# EAGLE schematic fsk_schematic (EAGLE 7.6.0)
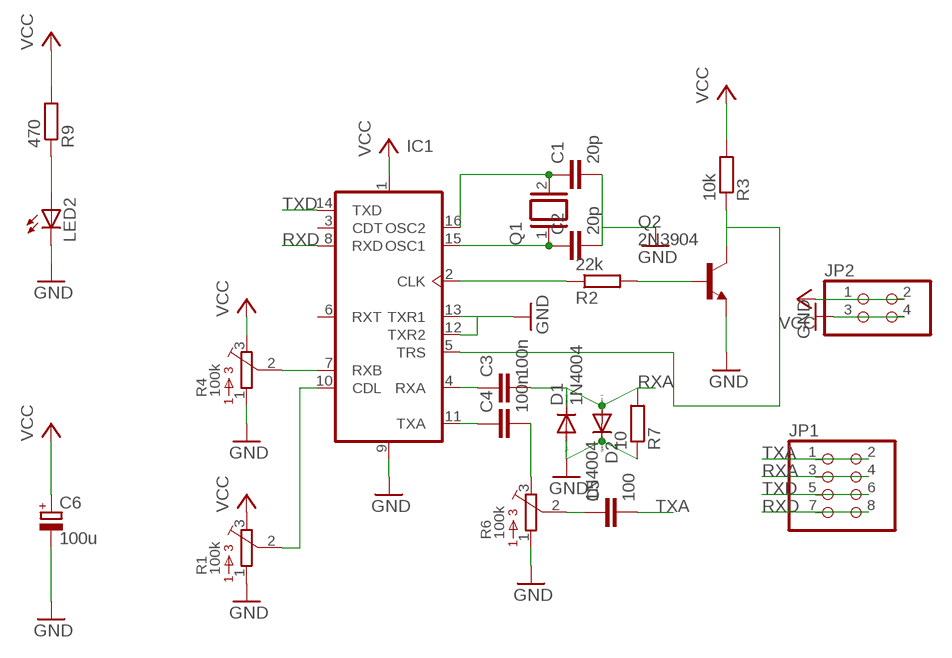
[diagram p0: schematic, sheet 1]

## Parts
C1  20p  C-EU025-024X044  [C025-024X044]
C2  20p  C-EU025-024X044  [C025-024X044]
C3  100n  C-EU050-045X075  [C050-045X075]
C4  100n  C-EU050-045X075  [C050-045X075]
C5  100  C-EU050-045X075  [C050-045X075]
C6  100u  CPOL-EUE2.5-7  [E2,5-7]
D1  1N4004  [DO41-10]
D2  1N4004  [DO41-10]
IC1  TCM3105  [DIL16]
JP1  PINHD-2X4  [2X04]
JP2  PINHD-2X2  [2X02]
LED2  LED5MM  [LED5MM]
Q1  XTAL/S  [QS]
Q2  2N3904  [TO92]
R1  100k  3386-C  [3386C]
R2  22k  R-EU_0204/7  [0204/7]
R3  10k  R-EU_0204/7  [0204/7]
R4  100k  3386-C  [3386C]
R6  100k  3386-C  [3386C]
R7  10  R-EU_0204/7  [0204/7]
R9  470  R-EU_0204/7  [0204/7]

## Nets
GND: C1.2 C2.2 C6.- D1.A D2.C IC1.9(VSS) IC1.12(TXR2) IC1.13(TXR1) JP2.3 JP2.4 LED2.K(C) Q2.3(E) R1.1 R4.1 R6.1 R7.1
N$1: IC1.10(CDL) R1.2
N$4: C2.1 IC1.15(OSC1) Q1.1
N$5: C1.1 IC1.16(OSC2) Q1.2
N$7: IC1.2(CLK) R2.1
N$8: Q2.2(B) R2.2
N$9: IC1.5(TRS) Q2.1(C) R3.1
N$10: LED2.A R9.1
N$13: IC1.7(RXB) R4.2
N$15: C3.1 IC1.4(RXA)
N$16: C4.1 IC1.11(TXA)
N$17: C4.2 R6.3
N$18: C5.1 R6.2
RXA: C3.2 D1.C D2.A JP1.3 JP1.4 R7.2
RXD: IC1.8(RXD) JP1.7 JP1.8
TXA: C5.2 JP1.1 JP1.2
TXD: IC1.14(TXD) JP1.5 JP1.6
VCC: C6.+ IC1.1(VDD) JP2.1 JP2.2 R1.3 R3.2 R4.3 R9.2
Unconnected: IC1.3(CDT) IC1.6(RXT)

## Library data of the parts
C1-C5 = rcl:C-EU: CAPACITOR, European symbol
C6 = rcl:CPOL-EU: POLARIZED CAPACITOR, European symbol
D1 D2 = diode:1N4004: DIODE general purpose rectifier, 1 A
IC1 = tcm3105:TCM3105
JP1 = pinhead:PINHD-2X4: PIN HEADER
JP2 = pinhead:PINHD-2X2: PIN HEADER
LED2 = led:LED: LED OSRAM: - CHIPLED LG R971, LG N971, LY N971, LG Q971, LY Q971, LO R971, LY R971 LH N974, LH R974 LS Q976, LO Q976, LY Q976 LO Q996 - Hyper CHIPLED LW Q18S LB Q993, LB Q99A, LB R99A - SideLED LS A670, LO A670, LY A670, LG A670, LP A670 LB A673, LV A673, LT A673, LW A673 LH A674 LY A675 LS A676, LA A676, LO A676, LY A676, LW A676 LS A679, LY A679, LG A679 - Hyper Micro SIDELED® LS Y876, LA Y876, LO Y876, LY Y876 LT Y87S - SmartLED LW L88C, LW L88S LB L89C, LB L89S, LG L890 LS L89K, LO L89K, LY L89K LS L896, LA L896, LO L896, LY L896 - TOPLED LS T670, LO T670, LY T670, LG T670, LP T670 LSG T670, LSP T670, LSY T670, LOP T670, LYG T670 LG T671, LOG T671, LSG T671 LB T673, LV T673, LT T673, LW T673 LH T674 LS T676, LA T676, LO T676, LY T676, LB T676, LH T676, LSB T676, LW T676 LB T67C, LV T67C, LT T67C, LS T67K, LO T67K, LY T67K, LW E67C LS E67B, LA E67B, LO E67B, LY E67B, LB E67C, LV E67C, LT E67C LW T67C LS T679, LY T679, LG T679 LS T770, LO T770, LY T770, LG T770, LP T770 LB T773, LV T773, LT T773, LW T773 LH T774 LS E675, LA E675, LY E675, LS T675 LS T776, LA T776, LO T776, LY T776, LB T776 LHGB T686 LT T68C, LB T68C - Hyper Mini TOPLED® LB M676 - Mini TOPLED Santana® LG M470 LS M47K, LO M47K, LY M47K Source: http://www.osram.convergy.de LUXEON: - LUMILED® LXK2-PW12-R00, LXK2-PW12-S00, LXK2-PW14-U00, LXK2-PW14-V00 LXK2-PM12-R00, LXK2-PM12-S00, LXK2-PM14-U00 LXK2-PE12-Q00, LXK2-PE12-R00, LXK2-PE12-S00, LXK2-PE14-T00, LXK2-PE14-U00 LXK2-PB12-K00, LXK2-PB12-L00, LXK2-PB12-M00, LXK2-PB14-N00, LXK2-PB14-P00, LXK2-PB14-Q00 LXK2-PR12-L00, LXK2-PR12-M00, LXK2-PR14-Q00, LXK2-PR14-R00 LXK2-PD12-Q00, LXK2-PD12-R00, LXK2-PD12-S00 LXK2-PH12-R00, LXK2-PH12-S00 LXK2-PL12-P00, LXK2-PL12-Q00, LXK2-PL12-R00 Source: www.luxeon.com KINGBRIGHT: KA-3528ASYC Source: www.kingbright.com
Q1 = special:XTAL/S: CRYSTAL
Q2 = Johnboiles:2N3904: NPN Transistor
R1 R4 R6 = bourns:3386-: 3386 Series 3/8" Square Trimmer
R2 R3 R7 R9 = rcl:R-EU_: RESISTOR, European symbol